# Altium schematic sheet E17-PDU-LOAD_3.SchDoc
size A4
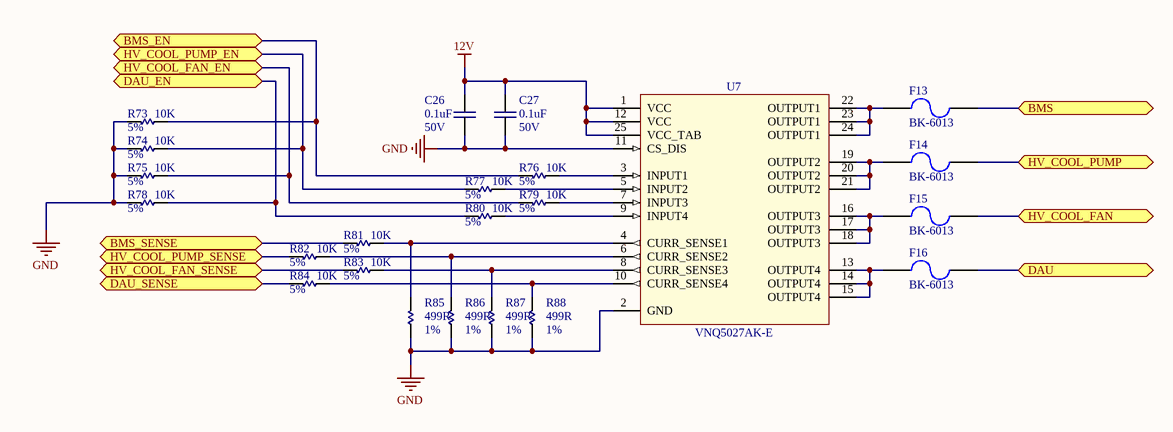
[diagram p0: E17-PDU-LOAD_3.SchDoc]

## Parts
C26  value 0.1uF  Voltage: 50V  [C0805]  (hidden comment: C_0805_Generic)
C27  value 0.1uF  Voltage: 50V  [C0805]  (hidden comment: C_0805_Generic)
F13  F_BK-6013  [BK-6013]  (value not drawn)
F14  F_BK-6013  [BK-6013]  (value not drawn)
F15  F_BK-6013  [BK-6013]  (value not drawn)
F16  F_BK-6013  [BK-6013]  (value not drawn)
R73  value 10K  Tolerance: 5%  [R0603]  (hidden comment: R_0603_Generic)
R74  value 10K  Tolerance: 5%  [R0603]  (hidden comment: R_0603_Generic)
R75  value 10K  Tolerance: 5%  [R0603]  (hidden comment: R_0603_Generic)
R76  value 10K  Tolerance: 5%  [R0603]  (hidden comment: R_0603_Generic)
R77  value 10K  Tolerance: 5%  [R0603]  (hidden comment: R_0603_Generic)
R78  value 10K  Tolerance: 5%  [R0603]  (hidden comment: R_0603_Generic)
R79  value 10K  Tolerance: 5%  [R0603]  (hidden comment: R_0603_Generic)
R80  value 10K  Tolerance: 5%  [R0603]  (hidden comment: R_0603_Generic)
R81  value 10K  Tolerance: 5%  [R0603]  (hidden comment: R_0603_Generic)
R82  value 10K  Tolerance: 5%  [R0603]  (hidden comment: R_0603_Generic)
R83  value 10K  Tolerance: 5%  [R0603]  (hidden comment: R_0603_Generic)
R84  value 10K  Tolerance: 5%  [R0603]  (hidden comment: R_0603_Generic)
R85  value 499R  Tolerance: 1%  [R0603]  (hidden comment: R_0603_Generic)
R86  value 499R  Tolerance: 1%  [R0603]  (hidden comment: R_0603_Generic)
R87  value 499R  Tolerance: 1%  [R0603]  (hidden comment: R_0603_Generic)
R88  value 499R  Tolerance: 1%  [R0603]  (hidden comment: R_0603_Generic)
U7  MFG_PN: VNQ5027AK-E  [PowerSSO-24]  (hidden comment: U_VNQ5027AK-E)

## Ports
BMS, BMS_EN, BMS_SENSE, DAU, DAU_EN, DAU_SENSE, HV_COOL_FAN, HV_COOL_FAN_EN, HV_COOL_FAN_SENSE, HV_COOL_PUMP, HV_COOL_PUMP_EN, HV_COOL_PUMP_SENSE

## Nets
12V: C26.1(EGND) C27.1(EGND) U7.1(VCC) U7.12(VCC) U7.25(VCC_TAB)
GND: C26.2 C27.2 R73.1 R74.1 R75.1 R78.1 R85.2 R86.2 R87.2 R88.2 U7.2(GND) U7.11(CS_DIS)
BMS: F13.2 ; port BMS
BMS_EN: R73.2 R76.1 ; port BMS_EN
BMS_SENSE: R81.1 ; port BMS_SENSE
DAU: F16.2 ; port DAU
DAU_EN: R78.2 R80.1 ; port DAU_EN
DAU_SENSE: R84.1 ; port DAU_SENSE
HV_COOL_FAN: F15.2 ; port HV_COOL_FAN
HV_COOL_FAN_EN: R75.2 R79.1 ; port HV_COOL_FAN_EN
HV_COOL_FAN_SENSE: R83.1 ; port HV_COOL_FAN_SENSE
HV_COOL_PUMP: F14.2 ; port HV_COOL_PUMP
HV_COOL_PUMP_EN: R74.2 R77.1 ; port HV_COOL_PUMP_EN
HV_COOL_PUMP_SENSE: R82.1 ; port HV_COOL_PUMP_SENSE
NetF13_1: F13.1 U7.22(OUTPUT1) U7.23(OUTPUT1) U7.24(OUTPUT1)
NetF14_1: F14.1 U7.19(OUTPUT2) U7.20(OUTPUT2) U7.21(OUTPUT2)
NetF15_1: F15.1 U7.16(OUTPUT3) U7.17(OUTPUT3) U7.18(OUTPUT3)
NetF16_1: F16.1 U7.13(OUTPUT4) U7.14(OUTPUT4) U7.15(OUTPUT4)
NetR76_2: R76.2 U7.3(INPUT1)
NetR77_2: R77.2 U7.5(INPUT2)
NetR79_2: R79.2 U7.7(INPUT3)
NetR80_2: R80.2 U7.9(INPUT4)
NetR81_2: R81.2 R85.1 U7.4(CURR_SENSE1)
NetR82_2: R82.2 R86.1 U7.6(CURR_SENSE2)
NetR83_2: R83.2 R87.1 U7.8(CURR_SENSE3)
NetR84_2: R84.2 R88.1 U7.10(CURR_SENSE4)

## Library data of the parts
C26 C27 = C_0805_Generic: Generic 0805 Capacitor; Tolerance: 10%; Supplier: Digikey; Supplier_PN: 399-1170-1-ND
F13-F16 = F_BK-6013: FUSE HOLDER BLADE PCB; MFG: MPD; Supplier: Digikey; Supplier_PN: BK-6013-ND; MFG_PN: BK-6013
R73-R84 = R_0603_Generic: Generic 0603 Resistor; Power: 1/10W; Supplier: Digikey; Supplier_PN: P10KGCT-ND
R85-R88 = R_0603_Generic: Generic 0603 Resistor; Power: 1/8W; Supplier: Digikey; Supplier_PN: RNCP0603FTD499RCT-ND
U7 = U_VNQ5027AK-E: LOAD CHANNEL HIGH SIDE 42A 4 Channel; MFG: STmicroelectronics; Supplier_PN: 497-11715-1-ND; Supplier: Digikey